# Altium schematic sheet 1_P1.schdoc
size 309 x 223 mm; Symbol: Sheet-Symbol_A4; Device: Sheet-Symbol_A4; Company: 嘉立创EDA; Version: V1.1; Page Size: A4; @Project Name: LM25118升降压DCDC电源模块; @Page Count: 1; @Update Date: 2023-07-07; @Create Date: 2023-07-03; @Schematic Name: Schematic1; @Page No: 1; @Page Name: P1
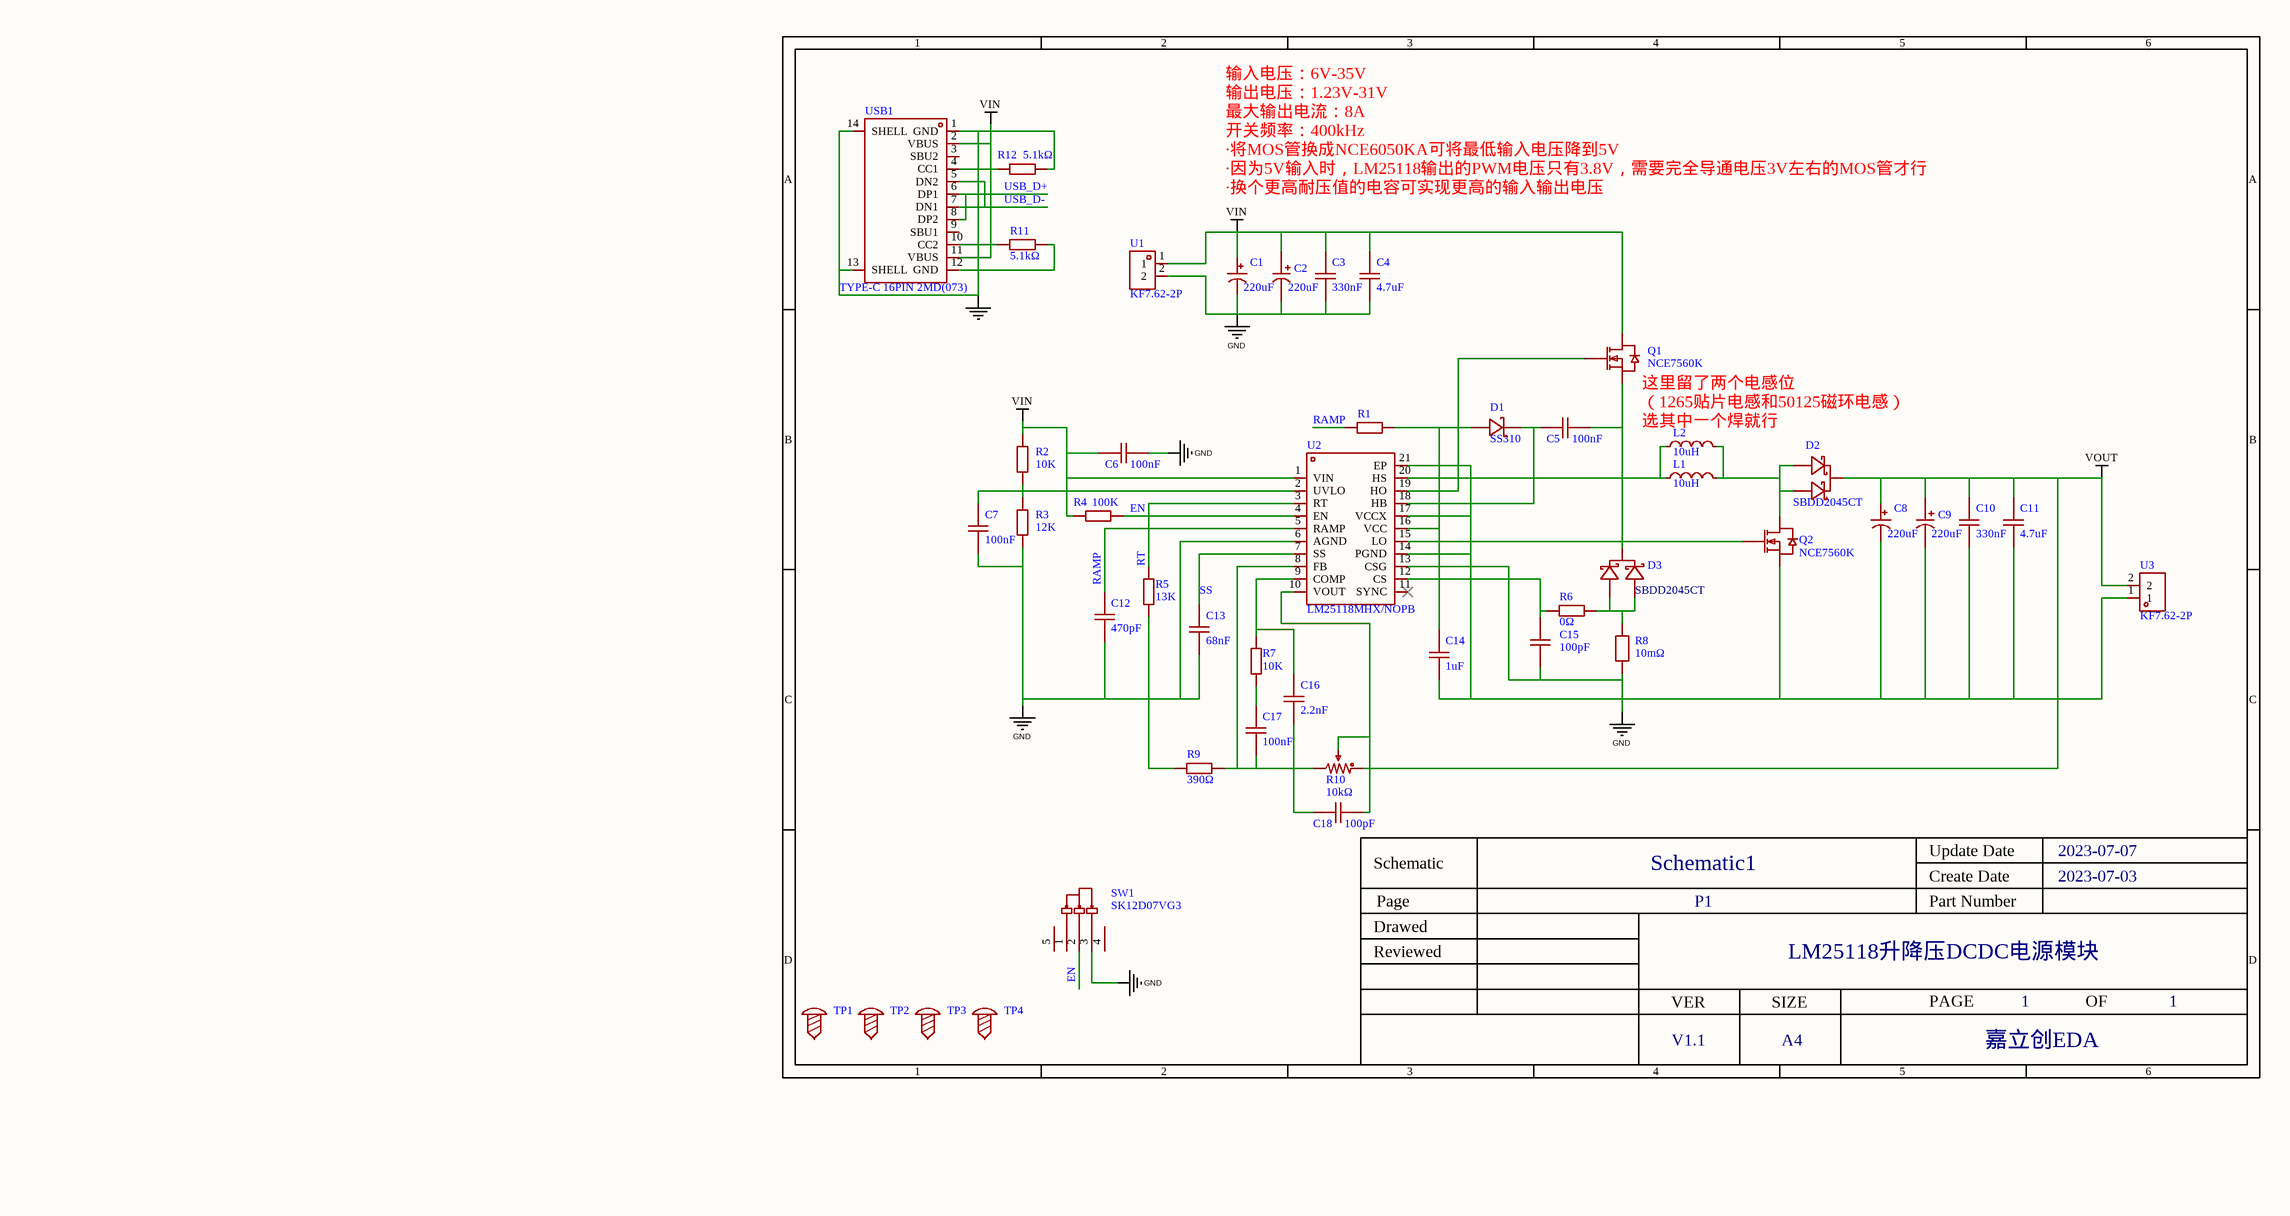
[diagram p0: 1_P1.schdoc]

## Parts
C1  220uF  [CAP-TH_BD8.0-P3.50-D0.6-FD]
C2  220uF  [CAP-TH_BD8.0-P3.50-D0.6-FD-2]
C3  330nF  [C0805]
C4  4.7uF  [C0805]
C5  100nF  [C0805]
C6  100nF  [C0805]
C7  100nF  [C0805]
C8  220uF  [CAP-TH_BD8.0-P3.50-D0.6-FD]
C9  220uF  [CAP-TH_BD8.0-P3.50-D0.6-FD-2]
C10  330nF  [C0805]
C11  4.7uF  [C0805]
C12  470pF  [C0805]
C13  68nF  [C0805]
C14  1uF  [C0805]
C15  100pF  [C0805]
C16  2.2nF  [C0805]
C17  100nF  [C0805]
C18  100pF  [C0805]
D1  SS310  [SMA_L4.3-W2.6-LS5.2-RD]
D2  SBDD2045CT  [TO-252-2_L6.5-W6.1-P4.58-LS10.0-TL]
D3  SBDD2045CT  [TO-252-2_L6.5-W6.1-P4.58-LS10.0-TL]
L1  10uH  [IND-TH_L16.5-W8.5-P11.00-D1.0]
L2  10uH  [IND-SMD_L13.5-W12.6]
Q1  NCE7560K  [TO-252-2_L6.6-W6.1-P4.57-LS9.9-TL-CW]
Q2  NCE7560K  [TO-252-2_L6.6-W6.1-P4.57-LS9.9-TL-CW]
R1  100K  [R0805]  (value not drawn)
R2  10K  [R0805]
R3  12K  [R0805]
R4  100K  [R0805]
R5  13K  [R0805]
R6  0Ω  [R0805]
R7  10K  [R0805]
R8  10mΩ  [RES-SMD_L6.4-W3.2-R2512]
R9  390Ω  [R0805]
R10  10kΩ  [RES-ADJ-TH_3P-L10.0-W10.0-P2.50-L]
R11  5.1kΩ  [R0805]
R12  5.1kΩ  [R0805]
SW1  SK12D07VG3  [SW-TH_SK12D07VG3]
TP1  (no value)  [M3螺丝]
TP2  (no value)  [M3螺丝]
TP3  (no value)  [M3螺丝]
TP4  (no value)  [M3螺丝]
U1  KF7.62-2P  [CONN-TH_2P-P7.62_KEFA_KF7.62-2P]
U2  LM25118MHX/NOPB  [HTSSOP-20_L6.5-W4.4-P0.65-LS6.4-BL-EP]
U3  KF7.62-2P  [CONN-TH_2P-P7.62_KEFA_KF7.62-2P]
USB1  TYPE-C 16PIN 2MD(073)  [USB-C-SMD_TYPE-C-6PIN-2MD-073]

## Nets
GND: C1.2 C2.2 C3.1 C4.1 C6.2 C7.1 C8.2 C9.2 C10.1 C11.1 C12.1 C13.1 C14.1 C15.1 Q2.3(S) R3.1 R5.1 R8.1 R9.1 R11.2 R12.2 SW1.3 U1.2 U2.6(AGND) U2.13(CSG) U2.14(PGND) U2.17(VCCX) U2.21(EP) U3.1 USB1.1(GND) USB1.12(GND) USB1.13(SHELL) USB1.14(SHELL)
VIN: C1.1 C2.1 C3.2 C4.2 C6.1 Q1.2(D) R2.2 R4.1 U1.1 U2.1(VIN) USB1.2(VBUS) USB1.11(VBUS)
VOUT: C8.1 C9.1 C10.2 C11.2 C18.2 D2.4(K) R10.1 R10.2 U2.10(VOUT) U3.2
EN: R4.2 SW1.2 U2.4(EN)
RAMP: C12.2 R1.1 U2.5(RAMP)
RT: R5.2 U2.3(RT)
SS: C13.2 U2.7(SS)
USB_D+: USB1.6(DP1) USB1.8(DP2)
USB_D-: USB1.5(DN2) USB1.7(DN1)
NetC5_1: C5.1 D1.1(K) U2.18(HB)
NetC5_2: C5.2 D3.4(K) L1.1 L2.1 Q1.3(S) U2.20(HS)
NetC7_2: C7.2 R2.1 R3.2 U2.2(UVLO)
NetC14_2: C14.2 D1.2(A) R1.2 U2.16(VCC)
NetC15_2: C15.2 R6.1 U2.12(CS)
NetC16_1: C16.1 C17.1 C18.1 R9.2 R10.3 U2.8(FB)
NetC16_2: C16.2 R7.2 U2.9(COMP)
NetC17_2: C17.2 R7.1
NetD2_1: D2.1(A) D2.3(A) L1.2 L2.2 Q2.2(D)
NetD3_1: D3.1(A) D3.3(A) R6.2 R8.2
NetQ1_1: Q1.1(G) U2.19(HO)
NetQ2_1: Q2.1(G) U2.15(LO)
NetR11_1: R11.1 USB1.10(CC2)
NetR12_1: R12.1 USB1.4(CC1)

Not connected (* = marked no-connect by the designer): SW1 1 4 5; TP1 1; TP2 1; TP3 1; TP4 1; U2 11(SYNC)*; USB1 3(SBU2) 9(SBU1)

## Notes on the sheet
- 输入电压：6V-35V
  输出电压：1.23V-31V
  最大输出电流：8A
  开关频率：400kHz
  ·将MOS管换成NCE6050KA可将最低输入电压降到5V
  ·因为5V输入时，LM25118输出的PWM电压只有3.8V，需要完全导通电压3V左右的MOS管才行
  ·换个更高耐压值的电容可实现更高的输入输出电压
- 这里留了两个电感位
  （1265贴片电感和50125磁环电感）
  选其中一个焊就行
- 1
- 2
- 3
- 4
- 5
- 6
- A
- B
- C
- Schematic
- Schematic1
- Create Date
- Update Date
- 2023-07-07
- 2023-07-03
- Reviewed
- Drawed
- Page
- P1
- Part Number
- LM25118升降压DCDC电源模块
- D
- VER
- SIZE
- PAGE
- OF
- V1.1
- A4
- 嘉立创EDA

## Library data of the parts
C1 C8 = GR227M035F12RR0VL4FP0: Manufacturer: CX(承兴); Symbol: 220uF 35V 8*12Green high frequency; Add into BOM: yes; Tolerance: ±20%; Rated Voltage: 35V; φD: 8mm; L: 12mm; Lifetime @ Temp: 3000hrs@105℃; Device: GR227M035F12RR0VL4FP0; LCSC Part Name: 220uF ±20% 35V 绿高频; Supplier Part: C45078; Manufacturer Part: GR227M035F12RR0VL4FP0; Supplier Footprint: 插件,D8xL12mm; JLCPCB Part Class: Extended Part; Datasheet: https://atta.szlcsc.com/upload/public/pdf/source/20211027/ED0DA65C69F42D9BDEC91091BA4C03CD.pdf; Supplier: LCSC; Convert to PCB: yes; Value: 220uF; Lead Spacing: 3.5mm; Ripple Current: -; Equivalent Series Resistance(ESR): -
C2 C9 = KNH2220UF35V149EC0049: Manufacturer: KNSCHA(科尼盛); Add into BOM: yes; Tolerance: ±20%; Rated Voltage: 35V; φD: 8mm; L: 9mm; Ripple Current: 1.7A@100kHz; Equivalent Series Resistance(ESR): 40mΩ@100kHz; Lifetime @ Temp: 2000hrs@105℃; Symbol: KNH2220UF35V149EC0049; Device: KNH2220UF35V149EC0049; LCSC Part Name: 220uF ±20% 35V; Supplier Part: C2981462; Manufacturer Part: KNH2220UF35V149EC0049; Supplier Footprint: 插件,8x9mm; JLCPCB Part Class: Extended Part; Datasheet: https://atta.szlcsc.com/upload/public/pdf/source/20220426/9FC8A158D93B909CC105160B4A0CB698.pdf; Supplier: LCSC; Convert to PCB: yes; Value: 220uF; Lead Spacing: 3.5mm; Operating Temperature: -55℃~+105℃
C3-C7 C10-C18 = CAP_0805: Symbol: CapAcitance; Convert to PCB: yes; Device: CAP_0805; Add into BOM: yes; Supplier Footprint: 0805
  C3 C10: Value: 330nF
  C4 C11: Value: 4.7uF
  C5-C7 C17: Value: 100nF
  C12: Value: 470pF
  C13: Value: 68nF
  C14: Value: 1uF
  C15 C18: Value: 100pF
  C16: Value: 2.2nF
D1 = SS310_C15874: Manufacturer: MDD; Add into BOM: yes; Reverse Voltage (Vr): 100V; Average Rectified Current (Io): 3A; Forward Voltage (Vf@If): 850mV@3A; Symbol: SS310; Device: SS310_C15874; LCSC Part Name: 100V 3A 850mV@3A; Supplier Part: C15874; Manufacturer Part: SS310; Supplier Footprint: SMA(DO-214AC); JLCPCB Part Class: Extended Part; Datasheet: https://atta.szlcsc.com/upload/public/pdf/source/20230314/A80AE34493C69B89E2F4B1712F433538.pdf; Supplier: LCSC; Convert to PCB: yes
D2 D3 = SBDD2045CT: Manufacturer: CJ(江苏长电/长晶); Add into BOM: yes; Diode Configuration: 1对共阴极; Reverse Voltage (Vr): 45V; Average Rectified Current (Io): 20A; Forward Voltage (Vf@If): 590mV@10A; Reverse Leakage Current (Ir): 10uA@45V; Symbol: SBDD2045CT; Device: SBDD2045CT; LCSC Part Name: 45V 20A 590mV@10A; Supplier Part: C513354; Manufacturer Part: SBDD2045CT; Supplier Footprint: TO-252-2; JLCPCB Part Class: Extended Part; Datasheet: https://atta.szlcsc.com/upload/public/pdf/source/20201021/C513354_E68D1D96E283ECDF8F05EECFDC642B25.pdf; Supplier: LCSC; Convert to PCB: yes
L1 = SLT050125T100MUB: Manufacturer: Sunltech(韩国顺磁); Add into BOM: yes; Type: 磁环电感; Tolerance: ±20%; Rated Current: 5A; DC Resistance: 10mΩ; Symbol: SLT050125T100MUB; Device: SLT050125T100MUB; LCSC Part Name: 10uH ±20% 5A 10mΩ 立式铁硅铝磁环电感 套管; Supplier Part: C326008; Manufacturer Part: SLT050125T100MUB; Supplier Footprint: 插件; JLCPCB Part Class: Extended Part; Datasheet: https://atta.szlcsc.com/upload/public/pdf/source/20181116/C326008_F1D5EB70A946A6606190F2FE73BB90E4.pdf; Supplier: LCSC; Convert to PCB: yes; Value: 10uH; Current - Saturation (Isat): -; Q @ Frequency: -; Frequency - Self Resonant: -; Ratings: -
L2 = XR1265-100M: Manufacturer: XR(祥如); Add into BOM: yes; Tolerance: ±20%; Rated Current: 10A; Saturation Current (Isat): 12.5A; DC Resistance (DCR): 20.7mΩ; Symbol: XR1265-100M; Device: XR1265-100M; LCSC Part Name: 10uH ±20% 10A 20.7mΩ; Supplier Part: C5339467; Manufacturer Part: XR1265-100M; Supplier Footprint: SMD,1265; Datasheet: https://atta.szlcsc.com/upload/public/pdf/source/20221228/8F25018F537F239E81AF9D59F9CE91EF.pdf; Supplier: LCSC; Convert to PCB: yes; Value: 10uH
Q1 Q2 = NCE7560K: Manufacturer: NCE(无锡新洁能); Add into BOM: yes; Type: N沟道; Drain Source Voltage (Vdss): 75V; Continuous Drain Current (Id): 60A; Power Dissipation (Pd): 140W; Drain Source On Resistance (RDS(on)@Vgs,Id): 8.5mΩ@10V,30A; Gate Threshold Voltage (Vgs(th)@Id): 4V@250uA; Symbol: NCE7560K; Device: NCE7560K; LCSC Part Name: N沟道 75V 60A; Supplier Part: C95273; Manufacturer Part: NCE7560K; Supplier Footprint: TO-252-2(DPAK); JLCPCB Part Class: Extended Part; Datasheet: https://atta.szlcsc.com/upload/public/pdf/source/20170211/1486785673842.pdf; Supplier: LCSC; Convert to PCB: yes
R1-R7 R9 = Res_0805: Symbol: 电阻; Convert to PCB: yes; Device: Res_0805; Add into BOM: yes; Supplier Footprint: 0805
  R1 R4: Value: 100K
  R2 R7: Value: 10K
  R3: Value: 12K
  R5: Value: 13K
  R6: Value: 0Ω
  R9: Value: 390Ω
R8 = HoJLR2512-3W-10mR-1%: Manufacturer: Milliohm(毫欧); Add into BOM: yes; Power(Watts): 3W; Symbol: HOJLR2512-3W-10MR-1%; Device: HoJLR2512-3W-10mR-1%; LCSC Part Name: 10mΩ 3W; Supplier Part: C2903468; Manufacturer Part: HoJLR2512-3W-10mR-1%; Supplier Footprint: 2512; JLCPCB Part Class: Extended Part; Datasheet: https://atta.szlcsc.com/upload/public/pdf/source/20211009/7525CABAB363C979E942C1DD41F1FEF0.pdf; Supplier: LCSC; Convert to PCB: yes; Value: 10mΩ
R10 = 3296W-1-103: Manufacturer: BOCHEN(博晨); Add into BOM: yes; Tolerance: ±10%; Symbol: 3296W-1-103; Device: 3296W-1-103; LCSC Part Name: 10kΩ ±10%; Supplier Part: C118954; Manufacturer Part: 3296W-1-103; Supplier Footprint: 插件; JLCPCB Part Class: Extended Part; Datasheet: https://atta.szlcsc.com/upload/public/pdf/source/20171114/C118954_15106326646611117443.pdf; Supplier: LCSC; Convert to PCB: yes; Value: 10kΩ
R11 R12 = 0805W8F5101T5E: Manufacturer: UNI-ROYAL(厚声); Symbol: 电阻; Add into BOM: yes; Tolerance: ±1%; Power(Watts): 125mW; Temperature Coefficient: ±100ppm/℃; Overload Voltage (Max): 150V; Device: 0805W8F5101T5E; LCSC Part Name: 5.1kΩ ±1% 125mW; Supplier Part: C27834; Manufacturer Part: 0805W8F5101T5E; Supplier Footprint: 0805; JLCPCB Part Class: Basic Part; Datasheet: https://atta.szlcsc.com/upload/public/pdf/source/20200306/C422600_1E6D84923E4A46A82E41ADD87F860B5C.pdf; Supplier: LCSC; Convert to PCB: yes; Type: 厚膜电阻; Value: 5.1kΩ; Operating Temperature Range: -55℃~+155℃
SW1 = SK12D07VG3: Manufacturer: SHOU HAN(首韩); Symbol: SK12D07VG3_C431547; Add into BOM: yes; Device: SK12D07VG3; LCSC Part Name: 两档位卧式拨动开关,柄长3MM; Supplier Part: C431547; Manufacturer Part: SK12D07VG3; Supplier Footprint: 插件; JLCPCB Part Class: Extended Part; Datasheet: https://atta.szlcsc.com/upload/public/pdf/source/20190925/C431547_01B93C6F3FA5C09E15F8CCBF4E6DB91A.pdf; Supplier: LCSC; Convert to PCB: yes
TP1-TP4 = M3螺丝: Symbol: 螺丝孔; Convert to PCB: yes; Device: M3螺丝; Add into BOM: yes; Supplier Footprint: 插件
U1 U3 = KF7.62-2P_C5173665: Manufacturer: KEFA(科发); Add into BOM: yes; Symbol: KF7.62-2P_C5173665; Device: KF7.62-2P_C5173665; LCSC Part Name: 绿色尼龙环保; Supplier Part: C5173665; Manufacturer Part: KF7.62-2P; Supplier Footprint: 插件,P=7.62mm; JLCPCB Part Class: Extended Part; Datasheet: https://atta.szlcsc.com/upload/public/pdf/source/20220915/0842C98F0805CE3BBD42ED115252704B.pdf; Supplier: LCSC; Convert to PCB: yes
U2 = LM25118MHX/NOPB: Manufacturer: TI(德州仪器); Add into BOM: yes; Function: 升压型；降压型; Number of Outputs: 1; Input Voltage: 3V~42V; Synchronous Rectification: 否; Topology: 升压式；降压式; Switching Frequency: 500kHz; Duty Cycle (Max): 75%; Symbol: LM25118MHX/NOPB; Device: LM25118MHX/NOPB; LCSC Part Name: 降压型 升压型 3V~42V 500kHz; Supplier Part: C470962; Manufacturer Part: LM25118MHX/NOPB; Supplier Footprint: HTSSOP-20-EP; JLCPCB Part Class: Extended Part; Datasheet: https://atta.szlcsc.com/upload/public/pdf/source/20191219/C470962_B4E0B445A5DDC9BDA17A6FD2A579B975.pdf; Supplier: LCSC; Convert to PCB: yes; Operating Temperature: -40℃~+125℃@(TJ)
USB1 = TYPE-C 16PIN 2MD(073): Manufacturer: SHOU HAN(首韩); Add into BOM: yes; Gender: 母座; Number of Contacts: 16; Number of Ports: 1; Current Rating - Power (Max): 5A; Symbol: TYPE-C 16PIN 2MD(073); Device: TYPE-C 16PIN 2MD(073); LCSC Part Name: TYPE-C母座 16P 4脚插件带定位柱 不锈钢外壳 2次模顶; Supplier Part: C2765186; Manufacturer Part: TYPE-C 16PIN 2MD(073); Supplier Footprint: SMD; JLCPCB Part Class: Extended Part; Datasheet: https://atta.szlcsc.com/upload/public/pdf/source/20211123/39B17C16241EAC15C5E277BDA434118E.pdf; Supplier: LCSC; Convert to PCB: yes; Connector Type: Type-C; Standard: -; Mounting Style: 卧贴; Operating Temperature Range: -25℃~+85℃